# EAGLE design LCmeter0-LCD-8pinlcd-PIC-COMP (EAGLE 7.6.0)
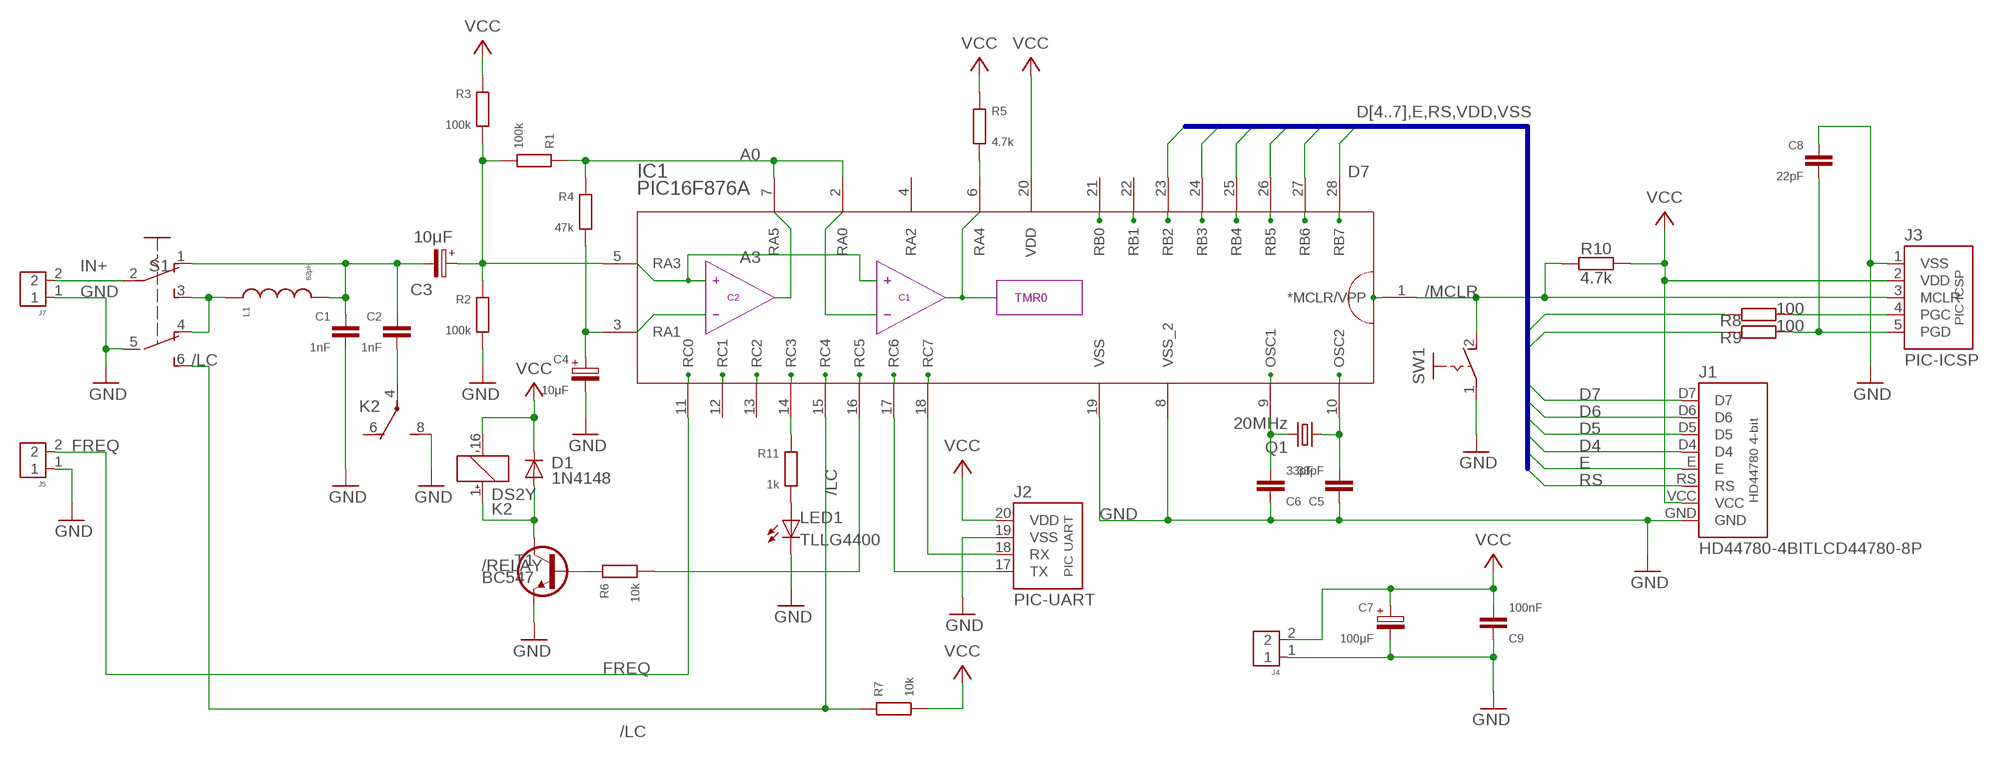
[diagram p0: schematic, sheet 1]

## Parts
C1  1nF  C025-025X060  [C050-025X060]
C2  1nF  C025-025X060  [C050-025X060]
C3  10μF  CPOLE2,5-4  [E2,5-4]
C4  10μF  CPOLE2,5-4  [E2,5-4]
C5  33pF  C025-020X036  [C025-020X036]
C6  33pF  C025-020X036  [C025-020X036]
C7  100μF  CPOLE2.5-5  [E2,5-5]
C8  22pF  C050-020X036  [C050-020X036]
C9  100nF  C025-020X036/V  [C025-020X036/V]
D1  1N4148  1N414834-7  [DO34-7]
IC1  PIC16F876A  PIC16F876A-X/SP-COMP-B-A  [DIL28-3]
J1  HD44780-4BITLCD44780-8P  [CONN-LCD44780]
J2  PIC-UART  [PIC-UART]
J3  PIC-ICSP  PIC-ICSPICSP  [PIC-ICSP]
J4  J4  CONN-2P2P/H  [CONN-2P]
J5  CONN-2P2P/V  [CONN-2P-V]
J7  CONN-2P2P/V  [CONN-2P-V]
K2  DS2Y  DS2Y-S-DC5V  [DS2Y]
L1  82μH  LAXIAL  [0207/10]
LED1  TLLG4400  [LED3MM]
Q1  20MHz  CRYSTALHC49  [HC49]
R1  100k  R0202/7  [0202/7]
R2  100k  R0202/7  [0202/7]
R3  100k  R0202/7  [0202/7]
R4  47k  R0202/7  [0202/7]
R5  4.7k  R0202/7  [0202/7]
R6  10k  R0202/7-V  [0202/7-V]
R7  10k  R0202/10-V  [0202/10-V]
R8  100  R0202/7-V  [0202/7-V]
R9  100  R0202/5-V  [0202/5-V]
R10  4.7k  R0202/7  [0202/7]
R11  1k  R0202/5-V  [0202/5-V]
S1  SL-SW-2P-2T  [SLSW-2P2T]
SW1  PB-1P-1T  [PB-1P1T]
T1  BC547  BC547CBE-A  [TO92-CBE-A]

## Nets
/LC: IC1.15(RC4) R7.2 S1.6(S1)
/MCLR: IC1.1(*MCLR/VPP) J3.3(MCLR) R10.2 SW1.2(S)
/RELAY: D1.A K2.1(1:+) T1.C
A0: IC1.2(RA0) IC1.7(RA5) R1.2 R4.2
A1: C4.+ IC1.3(RA1) R4.1
A3: C3.+ IC1.5(RA3) R1.1 R2.2 R3.1
A4: IC1.6(RA4) R5.1
C2_CON: C2.2 K2.4(2:P)
D4: IC1.25(RB4) J1.D4
D5: IC1.26(RB5) J1.D5
D6: IC1.27(RB6) J1.D6 R8.2
D7: IC1.28(RB7) J1.D7 R9.2
E: IC1.24(RB3) J1.E
FREQ: IC1.11(RC0) J5.2
GND: C1.2 C4.- C5.1 C6.1 C7.- C8.1 C9.1 IC1.8(VSS_2) IC1.19(VSS) J1.GND J2.19(VSS) J3.1(VSS) J4.1 J5.1 J7.1 K2.8(2:S) LED1.K(C) R2.1 S1.5(P1) SW1.1(P) T1.E
IN+: J7.2 S1.2(P)
N$1: LED1.A R11.1
N$2: C1.1 C2.1 C3.- L1.2 S1.1(O)
N$5: IC1.14(RC3) R11.2
N$6: R6.2 T1.B
N$7: L1.1 S1.3(S) S1.4(O1)
N$8: IC1.16(RC5) R6.1
N$9: IC1.18(RC7) J2.18(RX)
N$10: IC1.17(RC6) J2.17(TX)
OSC1: C6.2 IC1.9(OSC1) Q1.2
OSC2: C5.2 IC1.10(OSC2) Q1.1
PGC: J3.4(PGC) R8.1
PGD: C8.2 J3.5(PGD) R9.1
RS: IC1.23(RB2) J1.RS
VCC: C7.+ C9.2 D1.C IC1.20(VDD) J1.VCC J2.20(VDD) J3.2(VDD) J4.2 K2.16(1:-) R3.2 R5.2 R7.1 R10.1
Unconnected: IC1.4(RA2) IC1.12(RC1) IC1.13(RC2) IC1.21(RB0) IC1.22(RB1) K2.6(2:O) K2.9(3:S) K2.11(3:O) K2.13(3:P)

## Buses
D[4..7],E,RS,VDD,VSS

## Library data of the parts
C1 C2 C5 C6 C8 C9 = c:C: CAPACITOR, European symbol
C3 C4 C7 = c:CPOL: POLARIZED CAPACITOR, European symbol
D1 = d:1N4148
IC1 = mcu:PIC16F876A-X/SP-COMP-B-A
J1 = pinconn:HD44780-4BIT
J2 = pinconn:PIC-UART
J3 = pinconn:PIC-ICSP
J4 J5 J7 = pinconn:CONN-2P
K2 = relay:DS2Y-S-DC*: MINIATURE RELAY NAiS Source: http://www.mew-europe.com/.. en_ds_61005_0023.pdf; MPN: DS2Y-S-DC5V; OC_FARNELL: unknown; OC_NEWARK: 13P3268
L1 = r:L
LED1 = led:TLLG4400: Low Current (2mA) LED 3 mm Tinted Diffused Package color GREEN Source: Data sheet <http://www.farnell.com/datasheets/391098.pdf>; MF: VISHAY SEMICONDUCTOR; OC_FARNELL: 1612435
Q1 = q:CRYSTAL
R1-R11 = r:R: RESISTOR, European symbol
S1 = sw:SL-SW-2P-2T
SW1 = sw:PB-1P-1T
T1 = t:BC547

## Net classes
0 default: width 0.61 mm

## Board
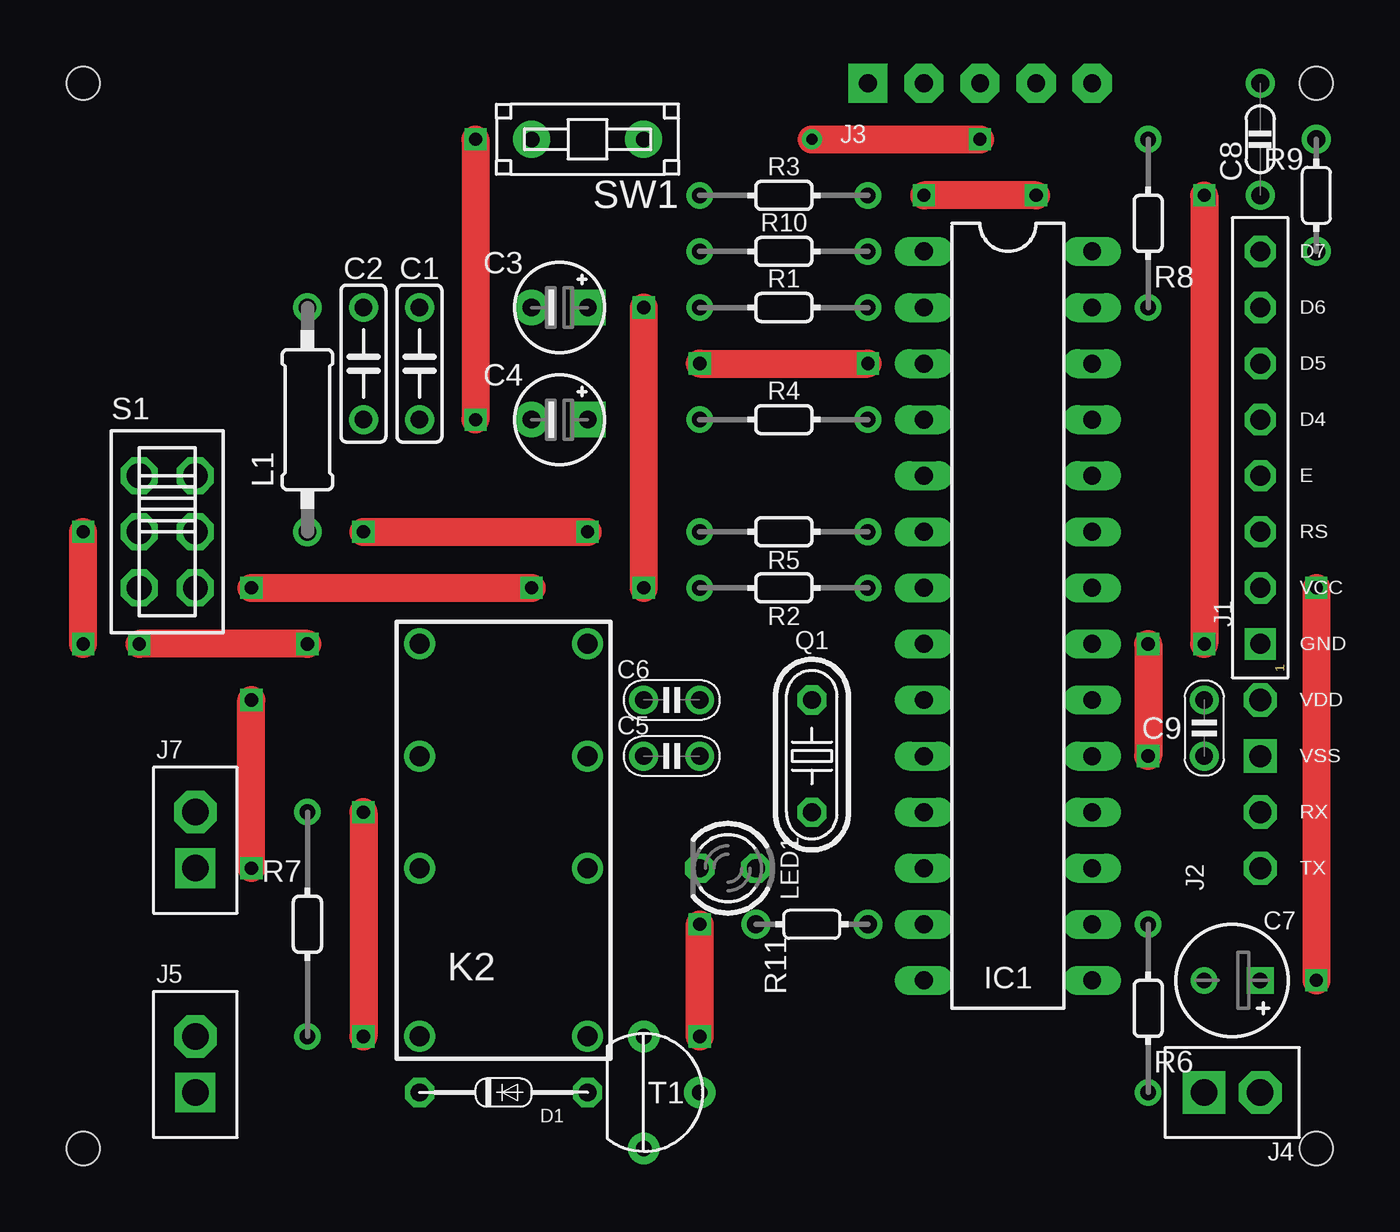
[diagram p1: board, top side]
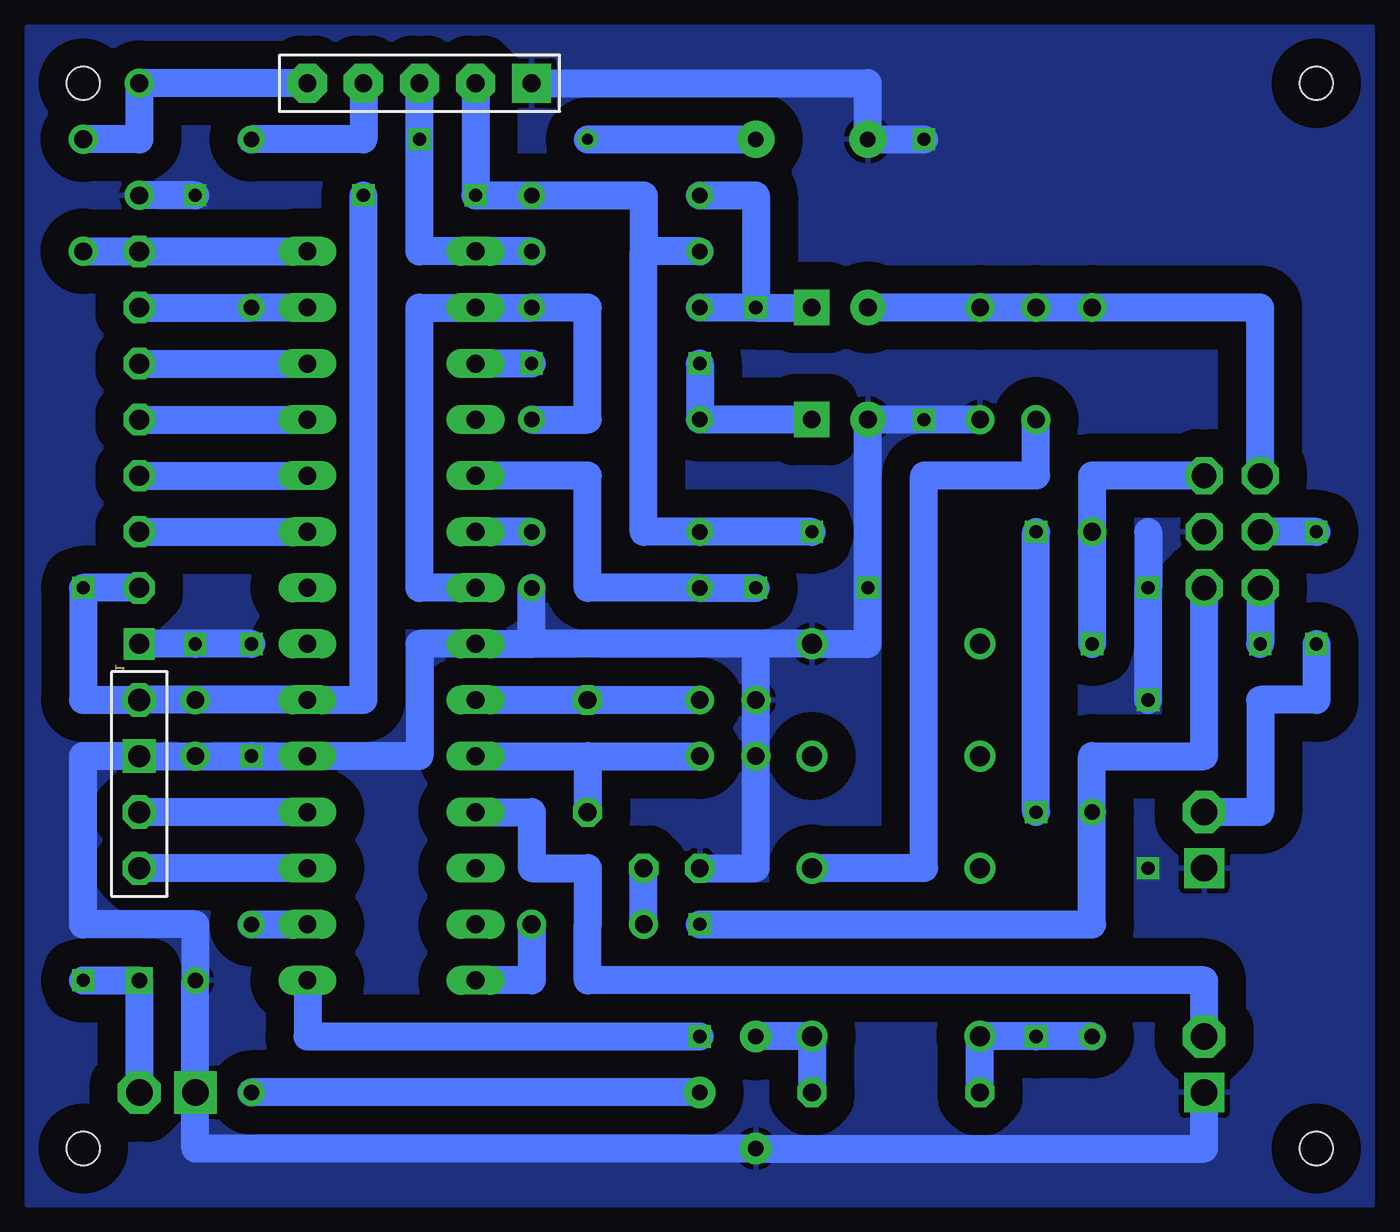
[diagram p2: board, bottom side, seen from below]

No outline drawn. Coordinates in mm, seen from the top.
Copper layers (1*16): Top 0.035mm / dielectric 1.5mm / Bottom 0.035mm
Design rules "default *": minimum track width 10mil, minimum drill 24mil, track to track 0mil, track to pad 0mil, pad to pad 0mil, via to via 0mil, smd to smd 8mil, copper to edge 40mil, drill to drill 8mil, minimum pad ring 10mil, minimum via ring 8mil, stop-mask expansion 4mil, vias tented up to drill 0mil, thermal gap 10mil
Holes 1.5 mm at 0,48.26 55.88,48.26 55.88,0 0,0

### Footprints (pad centres in the part's own frame; a part is rotated, then mirrored left to right if it is on the bottom)
C050-025X060 = drill 0.8: 1 0,2.54; 2 0,-2.54
E2,5-4 = drill 0.8 pad 1.6 square: + 1.27,0 | drill 0.8 pad 1.6: - -1.27,0
C025-020X036 = drill 0.8: 1 0,0; 2 2.54,0
E2,5-5 = drill 0.7 square: + 1.27,0 | drill 0.7: - -1.27,0
C050-020X036 = drill 0.8: 1 0,-2.54; 2 0,2.54
C025-020X036/V = drill 0.8: 1 0,-1.27; 2 0,1.27
DO34-7 = drill 0.813 octagon: A 3.81,0; C -3.81,0
DIL28-3 = drill 0.813 long: 1 -16.51,-3.81; 2 -13.97,-3.81; 3 -11.43,-3.81; 4 -8.89,-3.81; 5 -6.35,-3.81; 6 -3.81,-3.81; 7 -1.27,-3.81; 8 1.27,-3.81; 9 3.81,-3.81; 10 6.35,-3.81; 11 8.89,-3.81; 12 11.43,-3.81; 13 13.97,-3.81; 14 16.51,-3.81; 15 16.51,3.81; 16 13.97,3.81; 17 11.43,3.81; 18 8.89,3.81; 19 6.35,3.81; 20 3.81,3.81; 21 1.27,3.81; 22 -1.27,3.81; 23 -3.81,3.81; 24 -6.35,3.81; 25 -8.89,3.81; 26 -11.43,3.81; 27 -13.97,3.81; 28 -16.51,3.81
CONN-LCD44780 = drill 0.9 pad 1.422 octagon: D4 0,10.16; D5 0,12.7; D6 0,15.24; D7 0,17.78; E 0,7.62; RS 0,5.08; VCC 0,2.54 | drill 0.9 pad 1.422 square: GND 0,0
PIC-UART = drill 1 octagon: 17 0,0; 18 0,2.54; 20 0,7.62 | drill 1 square: 19 0,5.08
PIC-ICSP = drill 0.8 pad 1.778 square: 1 0,0 | drill 0.8 pad 1.778 octagon: 2 2.54,0; 3 5.08,0; 4 7.62,0; 5 10.16,0
CONN-2P = drill 1.2 pad 1.93 square: 1 0,0 | drill 1.2 pad 1.93 octagon: 2 -2.54,0
CONN-2P-V = drill 1.2 pad 1.778 square: 1 0,0 | drill 1.2 pad 1.93 octagon: 2 0,2.54
DS2Y = drill 0.9: 1 -8.89,-3.81; 4 -1.27,-3.81; 6 3.81,-3.81; 8 8.89,-3.81; 9 8.89,3.81; 11 3.81,3.81; 13 -1.27,3.81; 16 -8.89,3.81
0207/10 = drill 0.8: 1 -5.08,0; 2 5.08,0
LED3MM = drill 0.813 octagon: A -1.27,0; K 1.27,0
HC49 = drill 0.813 octagon: 1 0,-2.54; 2 0,2.54
0202/7 = drill 0.7: 1 -3.81,0; 2 3.81,0
0202/7-V = drill 0.7: 1 0,-3.81; 2 0,3.81
0202/10-V = drill 0.7: 1 0,-5.08; 2 0,5.08
0202/5-V = drill 0.8: 1 0,2.54; 2 0,-2.54
SLSW-2P2T = drill 1.118 pad 1.524 octagon: 1 -1.27,2.54; 2 -1.27,0; 3 -1.27,-2.54; 4 1.27,2.54; 5 1.27,0; 6 1.27,-2.54
PB-1P1T = drill 0.7 pad 1.676: 1 2.54,0; 2 -2.54,0
TO92-CBE-A = drill 0.7 pad 1.422: B 2.54,0; C 0,2.54; E 0,-2.54

### Placement (x,y rotation side)
C1  15.24,35.56 0 top
C2  12.7,35.56 0 top
C3  21.59,38.1 0 top
C4  21.59,33.02 0 top
C5  25.4,17.78 0 top
C6  25.4,20.32 0 top
C7  52.07,7.62 0 top
C8  53.34,45.72 0 top
C9  50.8,19.05 0 top
D1  19.05,2.54 0 top
IC1  41.91,24.13 270 top
J1  53.34,22.86 0 top
J2  53.34,12.7 0 top
J3  35.56,48.26 0 top
J4  50.8,2.54 180 top
J5  5.08,2.54 0 top
J7  5.08,12.7 0 top
K2  19.05,13.97 90 top
L1  10.16,33.02 90 top
LED1  29.21,12.7 180 top
Q1  33.02,17.78 0 top
R1  31.75,38.1 0 top
R2  31.75,25.4 180 top
R3  31.75,43.18 0 top
R4  31.75,33.02 0 top
R5  31.75,27.94 180 top
R6  48.26,6.35 180 top
R7  10.16,10.16 0 top
R8  48.26,41.91 180 top
R9  55.88,43.18 0 top
R10  31.75,40.64 0 top
R11  33.02,10.16 90 top
S1  3.81,27.94 0 top
SW1  22.86,45.72 180 top
T1  25.4,2.54 0 top

### Tracks (layer width: path | path; a pad name or v marks a point on that pad's centre or on a via)
/LC  (via drill 0.6)
  Top 1.27: v27.94,10.16 v27.94,5.08
  Bottom 1.27: IC1.15 45.72,5.08 v27.94,5.08 32.85,5.08 | v27.94,10.16 10.16,10.16 R7.2 10.16,17.78 5.08,17.78 S1.6
/MCLR  (via drill 0.5, 0.6)
  Top 1.27: v33.02,45.72 v40.64,45.72
  Bottom 1.27: J3.3 v40.64,45.72 40.64,40.64 IC1.1 R10.2 | v33.02,45.72 SW1.2
/RELAY
  Bottom 1.27: T1.C K2.1 D1.A
A0
  Bottom 1.27: IC1.7 40.64,25.4 40.64,38.1 IC1.2 R1.2 33.02,38.1 33.02,33.02 R4.2
A1  (via drill 0.6)
  Top 1.27: v27.94,35.56 v35.56,35.56
  Bottom 1.27: v35.56,35.56 IC1.3 | C4.+ R4.1 v27.94,35.56
A3  (via drill 0.6)
  Top 1.27: v25.4,38.1 v25.4,25.4
  Bottom 1.27: IC1.5 33.02,30.48 33.02,25.4 R2.2 v25.4,25.4 | R3.1 25.4,43.18 v25.4,38.1 | v25.4,38.1 R1.1 | v25.4,38.1 C3.+
A4
  Bottom 1.27: R5.1 IC1.6
C2_CON
  Bottom 1.27: K2.4 17.78,12.7 17.78,30.48 12.7,30.48 C2.2
D4
  Bottom 1.27: J1.D4 IC1.25
D5
  Bottom 1.27: J1.D5 IC1.26
D6
  Bottom 1.27: J1.D6 R8.2 IC1.27
D7
  Bottom 1.27: R9.2 J1.D7 IC1.28
E
  Bottom 1.27: J1.E IC1.24
FREQ
  Bottom 1.27: J5.2 5.08,7.62 33.02,7.62 33.02,10.16 33.02,12.7 35.56,12.7 35.56,15.24 IC1.11
GND  (via drill 0.6)
  Top 1.27: v48.26,22.86 v48.26,17.78 | v17.78,45.72 v17.78,33.02 | v50.8,43.18 v50.8,22.86 | v7.62,12.7 v7.62,20.32 | v7.62,25.4 v20.32,25.4
  Bottom 1.27: 35.56,22.86 IC1.8 40.64,22.86 40.64,17.78 IC1.19 v48.26,17.78 C9.1 J2.19 55.88,17.78 55.88,10.16 50.8,10.16 C7.- J4.1 50.8,0 T1.E 5.08,0 J5.1 | 25.4,22.86 C6.1 C5.1 25.4,12.7 LED1.K | 25.4,22.86 35.56,22.86 | 35.56,22.86 R2.1 | 25.4,22.86 K2.8 20.32,22.86 v20.32,25.4 C4.- v17.78,33.02 C1.2 | v48.26,22.86 v50.8,22.86 J1.GND | v17.78,45.72 SW1.1 20.32,48.26 J3.1 | v50.8,43.18 C8.1 | v7.62,20.32 v7.62,25.4 7.62,27.94
  pour Bottom (isolate 1.27): -2.54,50.8 58.42,50.8 58.42,-2.54 -2.54,-2.54
IN+  (via drill 0.6)
  Top 1.27: v0,22.86 v0,27.94
  Bottom 1.27: v0,27.94 S1.2 | v0,22.86 0,20.32 2.54,20.32 2.54,15.24 J7.2
N$1
  Bottom 1.27: R11.1 LED1.A
N$2
  Bottom 1.27: C1.1 C3.- | S1.1 2.54,38.1 L1.2 C1.1 | C2.1 C1.1
N$5
  Bottom 1.27: R11.2 35.56,7.62 IC1.14
N$6
  Bottom 1.27: T1.B R6.2
N$7  (via drill 0.6)
  Top 1.27: v10.16,22.86 v2.54,22.86
  Bottom 1.27: S1.3 v2.54,22.86 | S1.4 10.16,30.48 L1.1 v10.16,22.86
N$8
  Bottom 1.27: R6.1 IC1.16
N$9
  Bottom 1.27: IC1.18 J2.18
N$10
  Bottom 1.27: IC1.17 J2.17
OSC1
  Bottom 1.27: IC1.9 Q1.2 C6.2
OSC2
  Bottom 1.27: 33.02,17.78 C5.2 | IC1.10 33.02,17.78 | 33.02,17.78 Q1.1
PGC
  Bottom 1.27: J3.4 43.18,45.72 R8.1
PGD
  Bottom 1.27: J3.5 C8.2 53.34,45.72 R9.1
RS
  Bottom 1.27: J1.RS IC1.23
VCC  (via drill 0.6)
  Top 1.27: v12.7,15.24 v12.7,5.08 | v12.7,27.94 v22.86,27.94 | v43.18,43.18 v38.1,43.18 | v55.88,25.4 v55.88,7.62
  Bottom 1.27: R7.1 v12.7,5.08 K2.16 D1.C | 30.48,40.64 30.48,27.94 R5.2 v22.86,27.94 | v12.7,15.24 v12.7,27.94 | v43.18,43.18 43.18,20.32 IC1.20 C9.2 J2.20 55.88,20.32 v55.88,25.4 J1.VCC | J3.2 v38.1,43.18 R3.2 30.48,43.18 30.48,40.64 | R10.1 30.48,40.64 | J4.2 C7.+ v55.88,7.62

### Text on the board
Measures: 20 | 19 | 18 | 17 | 16 | 15 | 14 | 13 | 12 | 11 | 10 | 9 | 8 | 7 | 6 | 5 | 4 | 3 | 2 | 1 | 1 | 2 | 3 | 4 | 5 | 6 | 7 | 8 | 9 | 10 | 11 | 12 | 13 | 14 | 15 | 16 | 17 | 18 | 19 | 20 | 21 | 22 | 23